# Altium schematic sheet Processor.SchDoc
size 420 x 297 mm; SheetNumber: 6; SheetTotal: 10; PageSetup: Record=PageOptions|CenterHorizontal=True|CenterVertical=True|PrintScale=0.96|XCorrection=1.00|YCorrection=1.00|PrintKind=1|BorderSize=5000000|LeftOffset=0|BottomOffset=0|Orientation=2|PaperLength=4318|PaperWidth=2794|Scale=100|PaperSource=7|PrintQuality=600|MediaType=1|DitherType=10|PaperKind=11" x 17"|PrintScaleMode=1
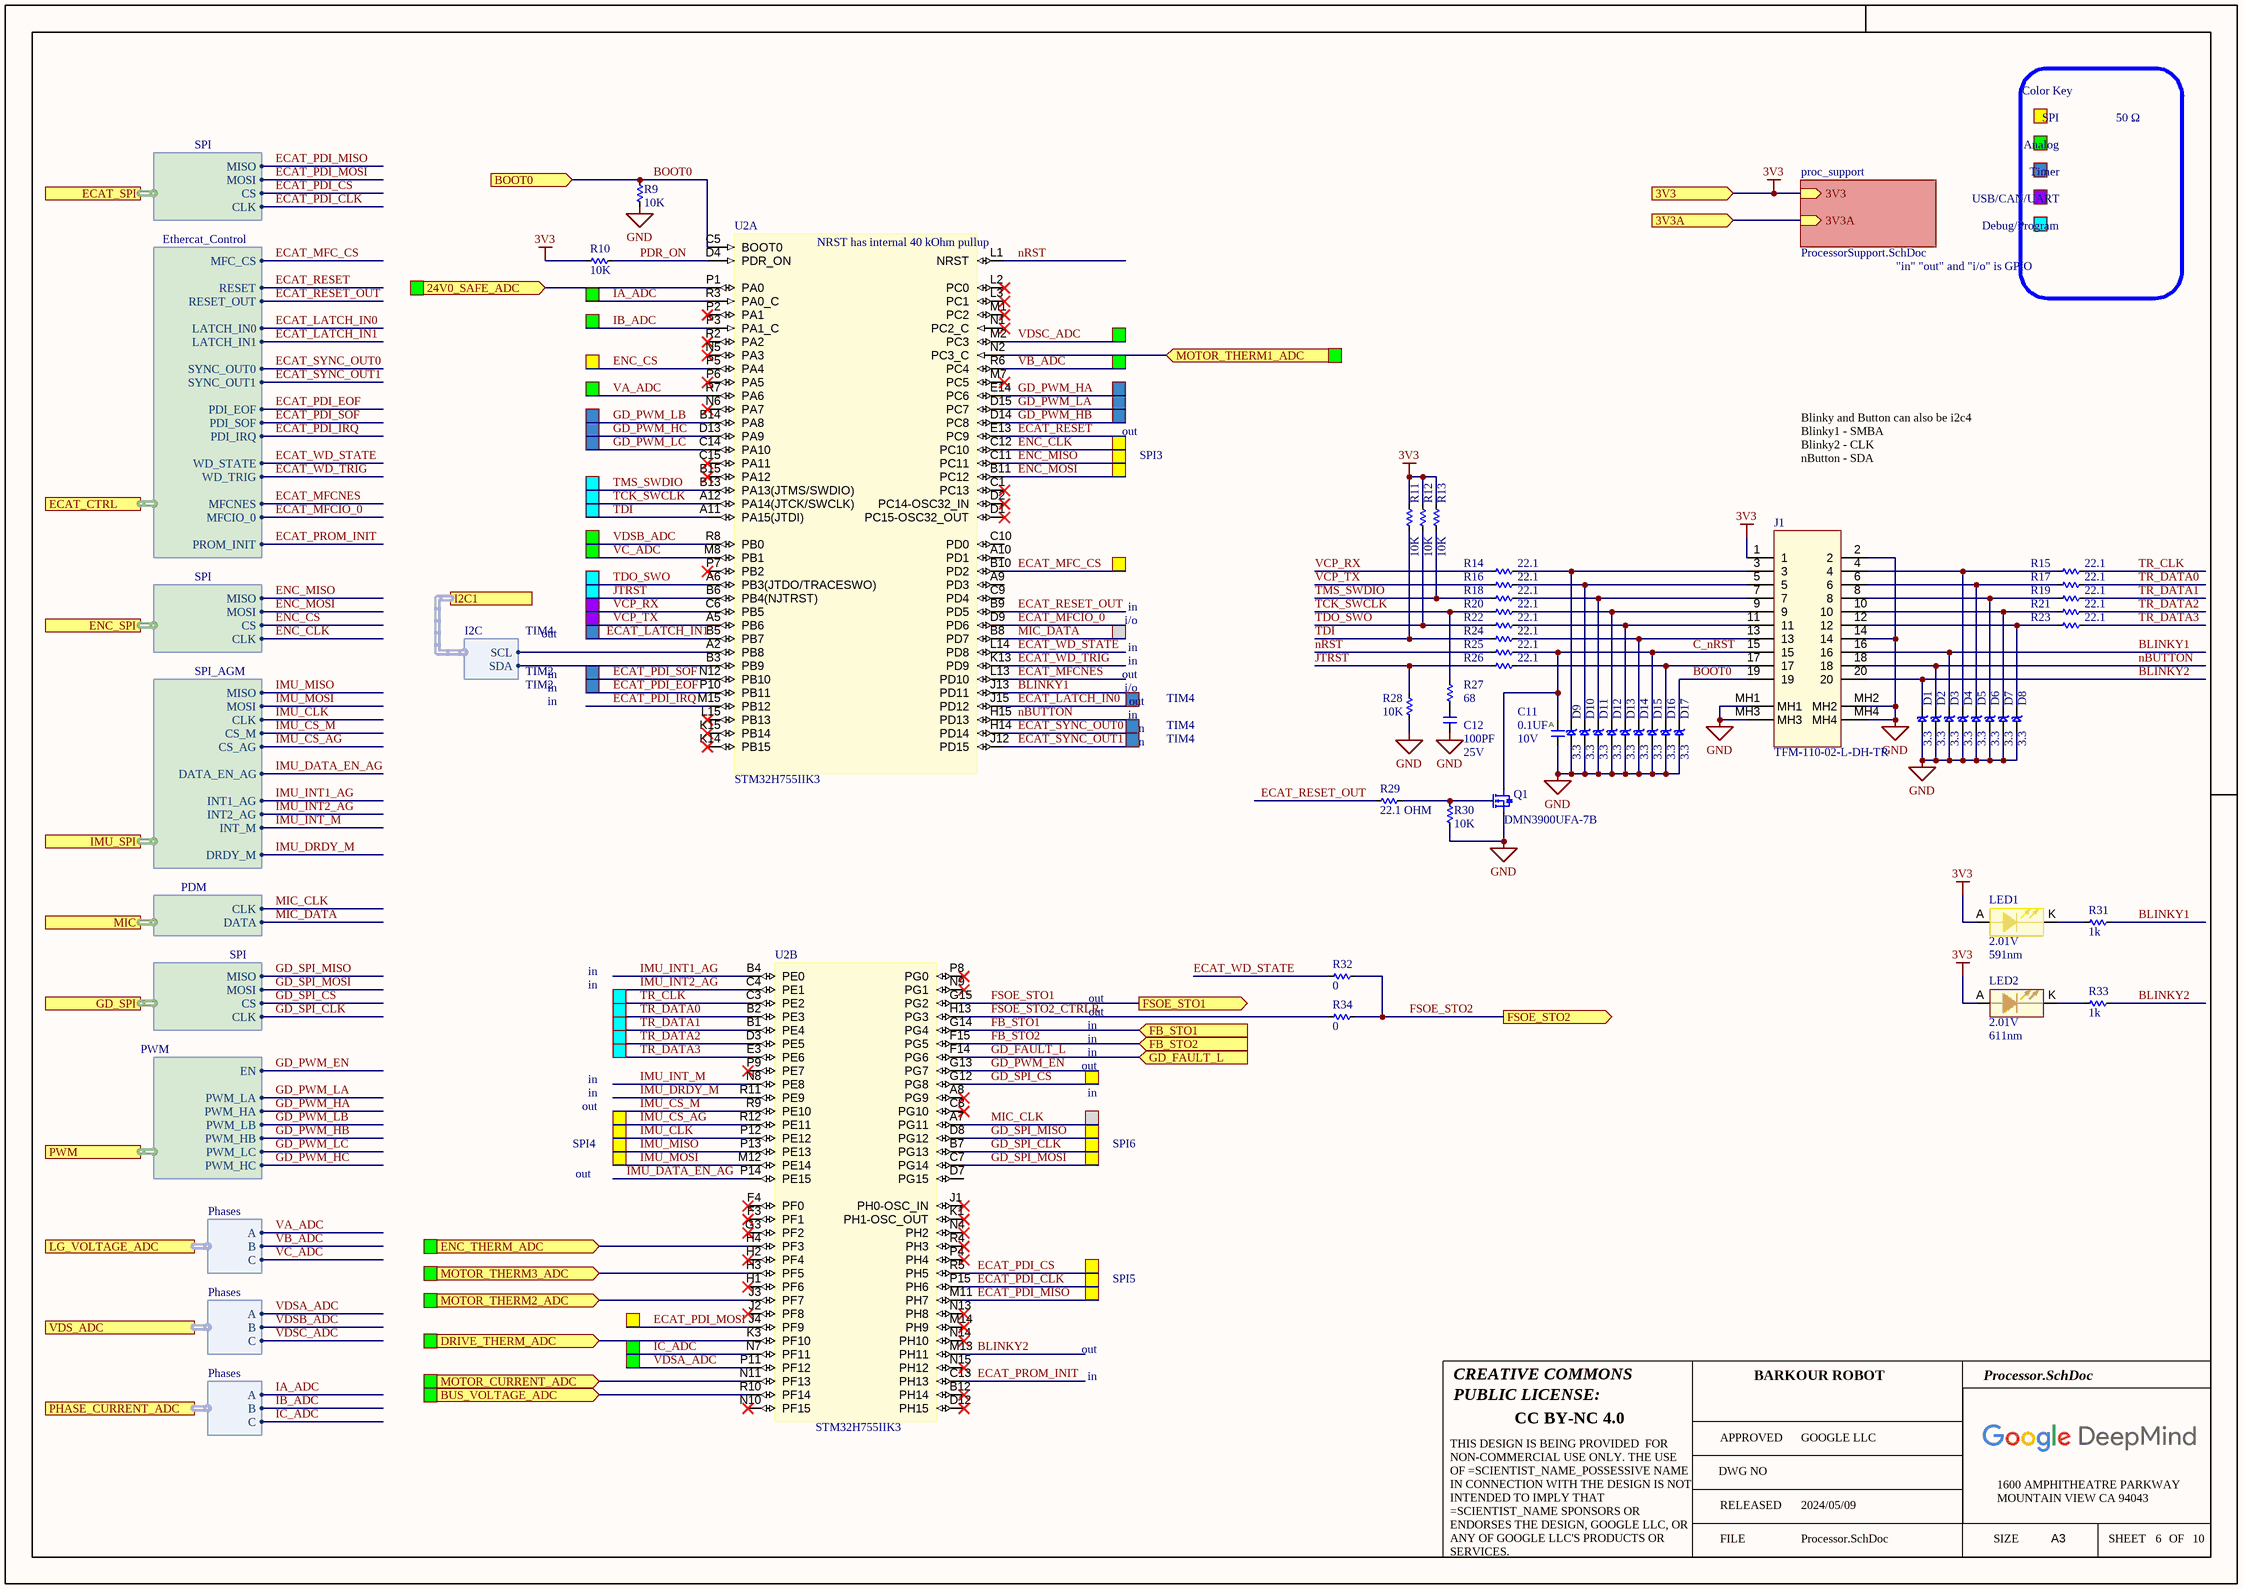
[diagram p0: Processor.SchDoc]

## Parts
C11  value 0.1UF  Voltage: 10V  [C0201Y]  (hidden comment: __Template_Cap_Auto)
C12  value 100PF  Voltage: 25V  [C0201Y]  (hidden comment: __Template_Cap)
D1  3.3  [SOD1060X40]
D2  3.3  [SOD1060X40]
D3  3.3  [SOD1060X40]
D4  3.3  [SOD1060X40]
D5  3.3  [SOD1060X40]
D6  3.3  [SOD1060X40]
D7  3.3  [SOD1060X40]
D8  3.3  [SOD1060X40]
D9  3.3  [SOD1060X40]
D10  3.3  [SOD1060X40]
D11  3.3  [SOD1060X40]
D12  3.3  [SOD1060X40]
D13  3.3  [SOD1060X40]
D14  3.3  [SOD1060X40]
D15  3.3  [SOD1060X40]
D16  3.3  [SOD1060X40]
D17  3.3  [SOD1060X40]
J1  MFG P/N: TFM-110-02-L-DH-TR  [SAMTEC_TFM-110-02-L-DH]
LED1  Voltage – Forward (VF) (MAX) @ IF: 2.01V  Color / Wavelength: 591nm  [LED_APG0603SYC-TT]  (hidden comment: __Template_LED_YELLOW_AK)
LED2  Voltage – Forward (VF) (MAX) @ IF: 2.01V  Color / Wavelength: 611nm  [LED_APG0603SYC-TT]  (hidden comment: __Template_LED_ORANGE_AK)
Q1  MFG P/N: DMN3900UFA-7B  [3XDFN]  (hidden comment: NFET_DMN3900UFA)
R9  value 10K  [R0201_H0.26MM]  (hidden comment: __Template_Resistor)
R10  value 10K  [R0201_H0.26MM]  (hidden comment: __Template_Resistor)
R11  value 10K  [R0201_H0.26MM]  (hidden comment: __Template_Resistor)
R12  value 10K  [R0201_H0.26MM]  (hidden comment: __Template_Resistor)
R13  value 10K  [R0201_H0.26MM]  (hidden comment: __Template_Resistor)
R14  value 22.1  [R0201_H0.26MM]  (hidden comment: __Template_Resistor)
R15  value 22.1  [R0201_H0.26MM]  (hidden comment: __Template_Resistor)
R16  value 22.1  [R0201_H0.26MM]  (hidden comment: __Template_Resistor)
R17  value 22.1  [R0201_H0.26MM]  (hidden comment: __Template_Resistor)
R18  value 22.1  [R0201_H0.26MM]  (hidden comment: __Template_Resistor)
R19  value 22.1  [R0201_H0.26MM]  (hidden comment: __Template_Resistor)
R20  value 22.1  [R0201_H0.26MM]  (hidden comment: __Template_Resistor)
R21  value 22.1  [R0201_H0.26MM]  (hidden comment: __Template_Resistor)
R22  value 22.1  [R0201_H0.26MM]  (hidden comment: __Template_Resistor)
R23  value 22.1  [R0201_H0.26MM]  (hidden comment: __Template_Resistor)
R24  value 22.1  [R0201_H0.26MM]  (hidden comment: __Template_Resistor)
R25  value 22.1  [R0201_H0.26MM]  (hidden comment: __Template_Resistor)
R26  value 22.1  [R0201_H0.26MM]  (hidden comment: __Template_Resistor)
R27  value 68  [R0201_H0.26MM]  (hidden comment: __Template_Resistor)
R28  value 10K  [R0201_H0.26MM]  (hidden comment: __Template_Resistor)
R29  value 22.1 OHM  [R0201_H0.26MM]  (hidden comment: __Template_Resistor)
R30  value 10K  [R0201_H0.26MM]  (hidden comment: __Template_Resistor)
R31  value 1k  [R0201_H0.26MM]  (hidden comment: __Template_Resistor)
R32  value 0  [R0603]  (hidden comment: __Template_Resistor)
R33  value 1k  [R0201_H0.26MM]  (hidden comment: __Template_Resistor)
R34  value 0  [R0603]  (hidden comment: __Template_Resistor)
U2  MFG P/N: STM32H755IIK3  [BGS201C65P15X15_1000X1000X60]  (hidden comment: MCU_STM32H755IIK3)  (parts A,B of 3)

## Sub-sheets
proc_support = ProcessorSupport.SchDoc: 3V3 (in), 3V3A (in)

## Ports
3V3 (in), 3V3A (in), 24V0_SAFE_ADC (in), BOOT0 (in), BUS_VOLTAGE_ADC (in), DRIVE_THERM_ADC (in), ECAT_CTRL (harness Ethercat_Control), ECAT_SPI (harness SPI), ENC_SPI (harness SPI), ENC_THERM_ADC (in), FB_STO1 (in), FB_STO2 (in), FSOE_STO1 (out), FSOE_STO2 (out), GD_FAULT_L (in), GD_SPI (harness SPI), I2C1 (harness I2C), IMU_SPI (harness SPI_AGM), LG_VOLTAGE_ADC (harness Phases), MIC (harness PDM), MOTOR_CURRENT_ADC (in), MOTOR_THERM1_ADC (in), MOTOR_THERM2_ADC (in), MOTOR_THERM3_ADC (in), PHASE_CURRENT_ADC (harness Phases), PWM (harness PWM), VDS_ADC (harness Phases)

## Harnesses
SPI: CLK, CS, MOSI, MISO
PDM: DATA, CLK
SPI: MISO, MOSI, CS, CLK
Ethercat_Control: MFC_CS, LATCH_IN0, LATCH_IN1, RESET_OUT, SYNC_OUT0, SYNC_OUT1, PDI_EOF, PDI_SOF, PDI_IRQ, RESET, WD_STATE, WD_TRIG, MFCNES, MFCIO_0, PROM_INIT
SPI_AGM: CLK, MOSI, CS_AG, DATA_EN_AG, CS_M, MISO, INT1_AG, INT2_AG, INT_M, DRDY_M
PWM: EN, PWM_LA, PWM_HA, PWM_LB, PWM_HB, PWM_LC, PWM_HC
Phases: A, B, C
I2C: SDA, SCL

## Nets
3V3: J1.1 LED1.A LED2.A R10.2 R11.2 R12.2 R13.2 ; port 3V3, sheet proc_support/3V3
GND: C11.2 C12.2 D1.A D2.A D3.A D4.A D5.A D6.A D7.A D8.A D9.A D10.A D11.A D12.A D13.A D14.A D15.A D16.A D17.A J1.2 J1.14 J1.MH1 J1.MH2 J1.MH3 J1.MH4 Q1.2(S) R9.1 R28.1 R30.1
3V3A: port 3V3A, sheet proc_support/3V3A
24V0_SAFE_ADC: U2.P1(PA0) ; port 24V0_SAFE_ADC
BLINKY1: D3.K J1.16 R31.1 U2.J13(PD11)
BLINKY2: D1.K J1.20 R33.1 U2.M13(PH11)
BOOT0: D17.K J1.19 R9.2 U2.C5(BOOT0) ; port BOOT0
BUS_VOLTAGE_ADC: U2.R10(PF14) ; port BUS_VOLTAGE_ADC
C_nRST: C11.1 D15.K J1.15 Q1.3(D) R25.2
DRIVE_THERM_ADC: U2.K3(PF10) ; port DRIVE_THERM_ADC
ECAT_LATCH_IN0: U2.J15(PD12) ; port ECAT_CTRL.LATCH_IN0
ECAT_LATCH_IN1: U2.B5(PB7) ; port ECAT_CTRL.LATCH_IN1
ECAT_MFC_CS: U2.B10(PD2) ; port ECAT_CTRL.MFC_CS
ECAT_MFCIO_0: U2.D9(PD6) ; port ECAT_CTRL.MFCIO_0
ECAT_MFCNES: U2.L13(PD10) ; port ECAT_CTRL.MFCNES
ECAT_PDI_CLK: U2.P15(PH6) ; port ECAT_SPI.CLK
ECAT_PDI_CS: U2.R5(PH5) ; port ECAT_SPI.CS
ECAT_PDI_EOF: U2.P10(PB11) ; port ECAT_CTRL.PDI_EOF
ECAT_PDI_IRQ: U2.M15(PB12) ; port ECAT_CTRL.PDI_IRQ
ECAT_PDI_MISO: U2.M11(PH7) ; port ECAT_SPI.MISO
ECAT_PDI_MOSI: U2.J4(PF9) ; port ECAT_SPI.MOSI
ECAT_PDI_SOF: U2.N12(PB10) ; port ECAT_CTRL.PDI_SOF
ECAT_PROM_INIT: U2.C13(PH13) ; port ECAT_CTRL.PROM_INIT
ECAT_RESET: U2.E13(PC9) ; port ECAT_CTRL.RESET
ECAT_RESET_OUT: R29.1 U2.B9(PD5) ; port ECAT_CTRL.RESET_OUT
ECAT_SYNC_OUT0: U2.H14(PD14) ; port ECAT_CTRL.SYNC_OUT0
ECAT_SYNC_OUT1: U2.J12(PD15) ; port ECAT_CTRL.SYNC_OUT1
ECAT_WD_STATE: R32.2 U2.L14(PD8) ; port ECAT_CTRL.WD_STATE
ECAT_WD_TRIG: U2.K13(PD9) ; port ECAT_CTRL.WD_TRIG
ENC_CLK: U2.C12(PC10) ; port ENC_SPI.CLK
ENC_CS: U2.P5(PA4) ; port ENC_SPI.CS
ENC_MISO: U2.C11(PC11) ; port ENC_SPI.MISO
ENC_MOSI: U2.B11(PC12) ; port ENC_SPI.MOSI
ENC_THERM_ADC: U2.H4(PF3) ; port ENC_THERM_ADC
FB_STO1: U2.G14(PG4) ; port FB_STO1
FB_STO2: U2.F15(PG5) ; port FB_STO2
FSOE_STO1: U2.G15(PG2) ; port FSOE_STO1
FSOE_STO2: R32.1 R34.1 ; port FSOE_STO2
FSOE_STO2_CTRLR: R34.2 U2.H13(PG3)
GD_FAULT_L: U2.F14(PG6) ; port GD_FAULT_L
GD_PWM_EN: U2.G13(PG7) ; port PWM.EN
GD_PWM_HA: U2.E14(PC6) ; port PWM.PWM_HA
GD_PWM_HB: U2.D14(PC8) ; port PWM.PWM_HB
GD_PWM_HC: U2.D13(PA9) ; port PWM.PWM_HC
GD_PWM_LA: U2.D15(PC7) ; port PWM.PWM_LA
GD_PWM_LB: U2.B14(PA8) ; port PWM.PWM_LB
GD_PWM_LC: U2.C14(PA10) ; port PWM.PWM_LC
GD_SPI_CLK: U2.B7(PG13) ; port GD_SPI.CLK
GD_SPI_CS: U2.G12(PG8) ; port GD_SPI.CS
GD_SPI_MISO: U2.D8(PG12) ; port GD_SPI.MISO
GD_SPI_MOSI: U2.C7(PG14) ; port GD_SPI.MOSI
IA_ADC: U2.R3(PA0_C) ; port PHASE_CURRENT_ADC.A
IB_ADC: U2.P3(PA1_C) ; port PHASE_CURRENT_ADC.B
IC_ADC: U2.N7(PF11) ; port PHASE_CURRENT_ADC.C
IMU_CLK: U2.P12(PE12) ; port IMU_SPI.CLK
IMU_CS_AG: U2.R12(PE11) ; port IMU_SPI.CS_AG
IMU_CS_M: U2.R9(PE10) ; port IMU_SPI.CS_M
IMU_DATA_EN_AG: U2.P14(PE15) ; port IMU_SPI.DATA_EN_AG
IMU_DRDY_M: U2.R11(PE9) ; port IMU_SPI.DRDY_M
IMU_INT1_AG: U2.B4(PE0) ; port IMU_SPI.INT1_AG
IMU_INT2_AG: U2.C4(PE1) ; port IMU_SPI.INT2_AG
IMU_INT_M: U2.N8(PE8) ; port IMU_SPI.INT_M
IMU_MISO: U2.P13(PE13) ; port IMU_SPI.MISO
IMU_MOSI: U2.M12(PE14) ; port IMU_SPI.MOSI
JTRST: R26.1 R28.2 U2.B6(PB4(NJTRST))
MIC_CLK: U2.A7(PG11) ; port MIC.CLK
MIC_DATA: U2.B8(PD7) ; port MIC.DATA
MOTOR_CURRENT_ADC: U2.N11(PF13) ; port MOTOR_CURRENT_ADC
MOTOR_THERM1_ADC: U2.N2(PC3_C) ; port MOTOR_THERM1_ADC
MOTOR_THERM2_ADC: U2.J3(PF7) ; port MOTOR_THERM2_ADC
MOTOR_THERM3_ADC: U2.H3(PF5) ; port MOTOR_THERM3_ADC
nBUTTON: D2.K J1.18 U2.H15(PD13)
nRST: R25.1 U2.L1(NRST)
PDR_ON: R10.1 U2.D4(PDR_ON)
TCK_SWCLK: R20.1 R27.2 U2.A12(PA14(JTCK/SWCLK))
TDI: R11.1 R24.1 U2.A11(PA15(JTDI))
TDO_SWO: R12.1 R22.1 U2.A6(PB3(JTDO/TRACESWO))
TMS_SWDIO: R13.1 R18.1 U2.B13(PA13(JTMS/SWDIO))
TR_CLK: R15.2 U2.C3(PE2)
TR_DATA0: R17.2 U2.B2(PE3)
TR_DATA1: R19.2 U2.B1(PE4)
TR_DATA2: R21.2 U2.D3(PE5)
TR_DATA3: R23.2 U2.E3(PE6)
VA_ADC: U2.R7(PA6) ; port LG_VOLTAGE_ADC.A
VB_ADC: U2.R6(PC4) ; port LG_VOLTAGE_ADC.B
VC_ADC: U2.M8(PB1) ; port LG_VOLTAGE_ADC.C
VCP_RX: R14.1 U2.C6(PB5)
VCP_TX: R16.1 U2.A5(PB6)
VDSA_ADC: U2.P11(PF12) ; port VDS_ADC.A
VDSB_ADC: U2.R8(PB0) ; port VDS_ADC.B
VDSC_ADC: U2.M2(PC3) ; port VDS_ADC.C
NetC12_1: C12.1 R27.1
NetD4_K: D4.K J1.4 R15.1
NetD5_K: D5.K J1.6 R17.1
NetD6_K: D6.K J1.8 R19.1
NetD7_K: D7.K J1.10 R21.1
NetD8_K: D8.K J1.12 R23.1
NetD9_K: D9.K J1.3 R14.2
NetD10_K: D10.K J1.5 R16.2
NetD11_K: D11.K J1.7 R18.2
NetD12_K: D12.K J1.9 R20.2
NetD13_K: D13.K J1.11 R22.2
NetD14_K: D14.K J1.13 R24.2
NetD16_K: D16.K J1.17 R26.2
NetLED1_K: LED1.K R31.2
NetLED2_K: LED2.K R33.2
NetQ1_1: Q1.1(G) R29.2 R30.2
NetU2_A2: U2.A2(PB8) ; port I2C1.SCL
NetU2_B3: U2.B3(PB9) ; port I2C1.SDA

Not connected (* = marked no-connect by the designer): U2 A8(PG9)* A9(PD3) A10(PD1) B12(PH14)* B15(PA12)* C1(PC13)* C8(PG10)* C9(PD4) C10(PD0) C15(PA11)* D1(PC15-OSC32_OUT)* D2(PC14-OSC32_IN)* D7(PG15) D12(PH15)* F3(PF1)* F4(PF0)* G3(PF2)* H1(PF6)* H2(PF4)* J1(PH0-OSC_IN)* J2(PF8)* K1(PH1-OSC_OUT)* K14(PB15)* K15(PB14)* L2(PC0)* L3(PC1)* L15(PB13)* M1(PC2)* M7(PC5)* M14(PH9)* N1(PC2_C)* N4(PH2)* N5(PA3)* N6(PA7)* N9(PG1)* N10(PF15)* N13(PH8)* N14(PH10)* N15(PH12)* P2(PA1)* P4(PH4)* P6(PA5)* P7(PB2)* P8(PG0)* P9(PE7)* R2(PA2)* R4(PH3)*

## Notes on the sheet
- SPI
- Color Key
- 50 Ω
- Analog
- Timer
- USB/CAN/UART
- (near U2) NRST has internal 40 kOhm pullup
- "in" "out" and "i/o" is GPIO
- Debug/Program
- out
- SPI3
- Blinky and Button can also be i2c4
  Blinky1 - SMBA
  Blinky2 - CLK
  nButton - SDA
- in
- TIM4
- i/o
- TIM2
- SPI4
- SPI6
- SPI5
- CREATIVE COMMONS
- PUBLIC LICENSE:
- BARKOUR ROBOT
- CC BY-NC 4.0
- APPROVED
- DWG NO
- GOOGLE LLC
- FILE
- RELEASED
- 2024/05/09
- SIZE
- 1600 AMPHITHEATRE PARKWAY
- MOUNTAIN VIEW CA 94043
- A3
- SHEET
- OF
- THIS DESIGN IS BEING PROVIDED  FOR NON-COMMERCIAL USE ONLY. THE USE OF =SCIENTIST_NAME_POSSESSIVE NAME IN CONNECTION WITH THE DESIGN IS NOT INTENDED TO IMPLY THAT =SCIENTIST_NAME SPONSORS OR ENDORSES THE DESIGN, GOOGLE LLC, OR ANY OF GOOGLE LLC'S PRODUCTS OR SERVICES.
- (in symbol 934) A

## Library data of the parts
C11 = 934: CAP, CER, X6S, 0.1uF, 10V, 10%, 0201, AUTOGRADE; ID: 934; MFG: MURATA; MFG P/N: GRT033C81A104KE01D; XPN: 150-01178-00; Gecko: 150-04546-00; EES: 150-04563-00; Status: Released; Package: 0201; Dielectric: X6S; Tolerance: 10%; Height: 0.33mm T; Supplier 1: Digi-key; HelpURL: https://www.digikey.com/product-detail/en/murata-electronics/GRT033C81A104KE01D/490-12232-1-ND/5416933; ComponentLink1Description: Datasheet; ComponentLink1URL: https://search.murata.co.jp/Ceramy/image/img/A01X/G101/ENG/GRT033C81A104KE01-01.pdf; COMMON: 150-01178-00; LOON: 150-01178-00; Supplier Part Number 1: 490-12232-1-ND
C12 = 767: CAP, CER, X7R, 100pF, 25V, 10%, 0201, 0.33mm T; ID: 767; MFG: MURATA; MFG P/N: GRM033R71E101KA01D; XPN: 150-00022-00; EES: 150-04573-00; Status: Released; Package: 0201; Dielectric: X7R; Tolerance: 10%; Height: 0.33mm T; ComponentLink1Description: Datasheet; COMMON: 150-00022-00; LOON: 150-00022-00; Gecko: 150-00022-00
D1-D17 = 192: TVS, DIODE, UNIDIR, 3.3VRWM, 4.8VBR, 7.8VCL, SOD-923; ID: 192; MFG: ON Semiconductor; MFG P/N: ESD9R3.3ST5G; Value: ESD9R3.3ST5G; Diode Type: Zener; PROXY: 480-01364-00; LOON: 430-00045-00; Voltage - Clamping (Max) @ Ipp: 7.8V; Status: Released; Package: SOD-923; Category: Diode; RoHS Compliant: Yes; Mounting Type: SMD; Operating Temperature – Junction: -55°C ~ 125°C (TJ); Supplier 1: Digi-Key; HelpURL: https://www.digikey.in/product-detail/en/on-semiconductor/ESD9R3.3ST5G/ESD9R3.3ST5GOSCT-ND/2704997; ComponentLink1Description: Datasheet; ComponentLink1URL: http://www.onsemi.com/pub/Collateral/ESD9R3.3S-D.PDF; Height: 0.4mm; Supplier Part Number 1: ESD9R3.3ST5GOSCT-ND
J1 = 1204: CONN, HDR, SHRD, RA, 2x10, 1.27MM P, 6.02MM h, GOLD, TH; ID: 1204; MFG: Samtec Inc; Connector Type: Header; Number of Positions: 20; Current Rating: 2.9A; Voltage, Rated: 275VAC; Sub Assy Qty 2: 0; EES: 210-04980-00; Status: Released; RoHS Compliant: Yes; Mounting Type: Surface Mount; Orientation: Right Angle; Pitch: 1.27mm; Number of Rows: 2; Row Spacing: 1.27mm; Gender: Header; Operating Temperature: -55°C ~ 125°C; Supplier 1: Digi-Key; HelpURL: https://www.digikey.com/en/products/detail/samtec-inc/TFM-110-02-L-DH-TR/6694026; ComponentLink1Description: Datasheet; ComponentLink1URL: http://suddendocs.samtec.com/prints/tfm-1xx-xx-x-dh-xx-mkt.pdf; Height: 6.02mm; Supplier Part Number 1: SAM14687TR-ND; Sub Assy Qty 3: 0; Sub Assy Qty 4: 0
LED1 = 307: LED, YELLOW, 591NM, 10mA, CLEAR, 0201; ID: 307; MFG: Kingbright; MFG P/N: APG0603SYC-TT; Value: APG0603SYC-TT; EES: 370-00612-00; Status: Released; Package: 0201; Category: LED; RoHS Compliant: Yes; Diode Type: LED; Mounting Type: SMD; Supplier 1: Digi-Key; HelpURL: https://www.digikey.com/product-detail/en/kingbright/APG0603SYC-TT/754-2025-1-ND/6072772; ComponentLink1Description: Datasheet; ComponentLink1URL: http://www.kingbrightusa.com/images/catalog/SPEC/APG0603SYC-TT.pdf; Height: 0.25mm; Supplier Part Number 1: 754-2025-1-ND
LED2 = 308: LED, ORANGE, 611NM, 10mA, CLEAR, 0201; ID: 308; MFG: Kingbright; MFG P/N: APG0603SEC-TT; Value: APG0603SEC-TT; EES: 370-00613-00; Status: Released; Package: 0201; Category: LED; RoHS Compliant: Yes; Diode Type: LED; Mounting Type: SMD; Supplier 1: Digi-Key; HelpURL: https://www.digikey.com/product-detail/en/kingbright/APG0603SEC-TT/754-2027-1-ND/6072774; ComponentLink1Description: Datasheet; ComponentLink1URL: http://www.kingbrightusa.com/images/catalog/SPEC/APG0603SEC-TT.pdf; Height: 0.25mm; Supplier Part Number 1: 754-2027-1-ND
Q1 = 24: MOSFET, N-CH, 30V, 0.55A, DMN3900; ID: 24; MFG: Diodes Incorporated; FET Type: MOSFET N-Channel, Metal Oxide; FET Feature: Logic Level Gate; Current - Continuios Drain (ID) @ 25° C: 550mA; RDS On (Max) @ ID, VGS: 760 mOhm @ 200mA, 4.5V; VGS(TH) (Max) @ ID: 950mV @ 250µA; Gate Charge (QG) @ VGS: 0.7nC @ 4.5V; Input Capacitance (CISS) @ VDS: 42.2pF @ 25V; Power - Max: 390mW; COMMON: 480-00750-00; XPN: XS-10020699; EES: 480-01751-00; Status: Released; Package: 3-XFDFN; Category: Discrete Semiconductor Products; RoHS Compliant: Yes; HelpURL: http://www.diodes.com/datasheets/DMN3900UFA.pdf; ComponentLink1Description: Datasheet; ComponentLink1URL: http://www.diodes.com/datasheets/DMN3900UFA.pdf; Voltage - Drain To Source (VDSS): 30V; Mounting Type: SM; Supplier 1: Digi-Key; LOON: 480-00750-00; Gecko: 480-00750-00; Supplier Part Number 1: DMN3900UFA-7BCT-ND
R9-R13 R28 R30 = 6783: RES, 10K, 1%, 1/20W, 0201, AUTOGRADE; ID: 6783; MFG: PANASONIC; MFG P/N: ERJ1GNF1002C; COMMON: 470-00033-00; PROXY: Use ID #4151; EES: 470-18014-00; Status: Released; Package: 0201; Power: 1/20W; Tolerance: 1%; Height: 0.26mm; Supplier 1: Digi-Key; HelpURL: https://www.digikey.in/product-detail/en/panasonic-electronic-components/ERJ-1GNF1002C/P122414CT-ND/7389440; ComponentLink1Description: Datasheet; ComponentLink1URL: https://industrial.panasonic.com/cdbs/www-data/pdf/RDA0000/AOA0000C304.pdf; LOON: 470-00033-00; Gecko: 470-00033-00; XPN: 470-00033-00; Supplier Part Number 1: P122414CT-ND
R14-R26 R29 = 10012: RES, 22.1, 1%, 1/20W, 0201, AUTOGRADE; ID: 10012; MFG: Panasonic Electronic Components; MFG P/N: ERJ-1GNF22R1C; Catagory: Chip Resistor - Surface Mount; Power: 0.05W, 1/20W; EES: 470-18023-00; Status: Released; Package: 0201; Tolerance: 1%; Height: 0.26mm; Supplier 1: Digi-Key; HelpURL: https://www.digikey.in/product-detail/en/panasonic-electronic-components/ERJ-1GNF22R1C/P122844CT-ND/8342627; ComponentLink1Description: Datasheet; ComponentLink1URL: https://industrial.panasonic.com/cdbs/www-data/pdf/RDA0000/AOA0000C304.pdf; Supplier Part Number 1: P122844CT-ND
R27 = 10014: RES, 68, 1%, 1/20W, 0201, AUTOGRADE; ID: 10014; MFG: Panasonic Electronic Components; MFG P/N: ERJ-1GNF68R0C; Catagory: Chip Resistor - Surface Mount; Power: 0.05W, 1/20W; EES: 470-18010-00; Status: Released; Package: 0201; Tolerance: 1%; Height: 0.26mm; Supplier 1: Digi-Key; HelpURL: https://www.digikey.in/product-detail/en/panasonic-electronic-components/ERJ-1GNF68R0C/P123132CT-ND/8343203; ComponentLink1Description: Datasheet; ComponentLink1URL: https://industrial.panasonic.com/cdbs/www-data/pdf/RDA0000/AOA0000C304.pdf; Supplier Part Number 1: P123132CT-ND
R31 R33 = 10010: RES, 1K, 1%, 1/20W, 0201, AUTOGRADE; ID: 10010; MFG: Bourns Inc.; MFG P/N: CR0201AFW-1001GLF; Power: 0.05W, 1/20W; Catagory: Chip Resistor - Surface Mount; EES: 470-18022-00; Status: Released; Package: 0201; Tolerance: 1%; Height: 0.26mm; Supplier 1: Digi-Key; HelpURL: https://www.digikey.in/product-detail/en/bourns-inc/CR0201AFW-1001GLF/118-CR0201AFW-1001GLFCT-ND/12091423; ComponentLink1Description: Datasheet; ComponentLink1URL: https://www.bourns.com/docs/product-datasheets/crxxxxa.pdf; Supplier Part Number 1: 118-CR0201AFW-1001GLFCT-ND
R32 R34 = 3: RES, JUMPER, 0, 1/10W, 0603; ID: 3; MFG: ROHM; MFG P/N: MCR03EZPJ000; COMMON: 470-03590-00; PROXY: Use ID #8521; XPN: XS-10014546; EES: 470-17795-00; Status: NRND; Package: 0603; Power: 1/10W; Tolerance: JUMPER; Height: 0.55mm; Supplier 1: Digi-Key; Supplier Part Number 1: RHM0.0GCT-ND; LOON: 470-03590-00; Gecko: 470-03590-00
U2 = 112: IC, MCU, STM32H755xI, ARM, 32-BIT, 240MHZ, 128 I/O, 2MB, FLASH, 1.62V TO 3.6V, UFBGA-201; ID: 112; MFG: STMicroelectronics; EES: 313-05804-00; Status: Released; Package: 176+25UFBGA (10x10); Category: Integrated Circuits (ICs); RoHS Compliant: Yes; Supplier 1: Digi-Key; HelpURL: https://www.digikey.com/products/en?keywords=STM32H755IIK3; ComponentLink1Description: Datasheet; ComponentLink1URL: https://www.st.com/resource/en/datasheet/stm32h755ii.pdf; Height: 0.6mm; Supplier Part Number 1: 497-STM32H755IIK3-ND